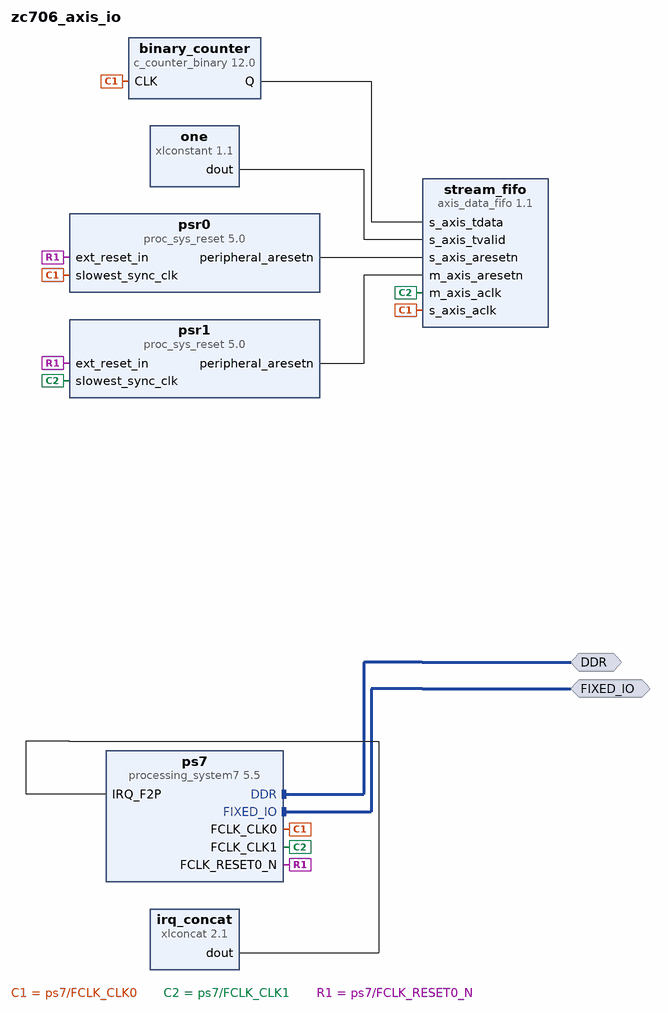
[diagram p0: block diagram of the top level]
# Vivado block design zc706_axis_io, xc7z045ffg900-2, Vivado 2016.3_sdx
create_bd_design zc706_axis_io

create_bd_intf_port -mode Master -vlnv xilinx.com:interface:ddrx_rtl:1.0 DDR
create_bd_intf_port -mode Master -vlnv xilinx.com:display_processing_system7:fixedio_rtl:1.0 FIXED_IO

create_bd_cell -type ip -vlnv xilinx.com:ip:c_counter_binary:12.0 binary_counter
set_property -dict {CONFIG.Output_Width 32} [get_bd_cells binary_counter]
create_bd_cell -type ip -vlnv xilinx.com:ip:xlconcat:2.1 irq_concat
set_property -dict {CONFIG.NUM_PORTS 1} [get_bd_cells irq_concat]
create_bd_cell -type ip -vlnv xilinx.com:ip:xlconstant:1.1 one
create_bd_cell -type ip -vlnv xilinx.com:ip:processing_system7:5.5 ps7
set_property -dict [list \
  CONFIG.PCW_FPGA1_PERIPHERAL_FREQMHZ 50 \
  CONFIG.PCW_USE_M_AXI_GP0 0 \
  CONFIG.PCW_USE_FABRIC_INTERRUPT 1 \
  CONFIG.PCW_EN_CLK1_PORT 1 \
  CONFIG.PCW_IRQ_F2P_INTR 1 \
  CONFIG.PCW_QSPI_GRP_IO1_ENABLE 1 \
  CONFIG.PCW_TTC0_PERIPHERAL_ENABLE 1 \
  CONFIG.preset ZC706 \
] [get_bd_cells ps7]
create_bd_cell -type ip -vlnv xilinx.com:ip:proc_sys_reset:5.0 psr0
create_bd_cell -type ip -vlnv xilinx.com:ip:proc_sys_reset:5.0 psr1
create_bd_cell -type ip -vlnv xilinx.com:ip:axis_data_fifo:1.1 stream_fifo
set_property -dict {CONFIG.TDATA_NUM_BYTES 4 CONFIG.FIFO_DEPTH 512 CONFIG.IS_ACLK_ASYNC 1} [get_bd_cells stream_fifo]

# ---- connections ----

connect_bd_intf_net -intf_net processing_system7_0_DDR [get_bd_intf_ports DDR] [get_bd_intf_pins ps7/DDR]
connect_bd_intf_net -intf_net processing_system7_0_FIXED_IO [get_bd_intf_ports FIXED_IO] [get_bd_intf_pins ps7/FIXED_IO]
connect_bd_net [get_bd_pins binary_counter/Q] [get_bd_pins stream_fifo/s_axis_tdata]
connect_bd_net [get_bd_pins one/dout] [get_bd_pins stream_fifo/s_axis_tvalid]
connect_bd_net -net processing_system7_0_FCLK_CLK0 [get_bd_pins ps7/FCLK_CLK0] \
  [get_bd_pins binary_counter/CLK] [get_bd_pins psr0/slowest_sync_clk] [get_bd_pins stream_fifo/s_axis_aclk]
connect_bd_net -net processing_system7_0_FCLK_CLK1 [get_bd_pins ps7/FCLK_CLK1] \
  [get_bd_pins psr1/slowest_sync_clk] [get_bd_pins stream_fifo/m_axis_aclk]
connect_bd_net -net processing_system7_0_FCLK_RESET0_N [get_bd_pins ps7/FCLK_RESET0_N] [get_bd_pins psr0/ext_reset_in] [get_bd_pins psr1/ext_reset_in]
connect_bd_net [get_bd_pins psr0/peripheral_aresetn] [get_bd_pins stream_fifo/s_axis_aresetn]
connect_bd_net [get_bd_pins psr1/peripheral_aresetn] [get_bd_pins stream_fifo/m_axis_aresetn]
connect_bd_net [get_bd_pins irq_concat/dout] [get_bd_pins ps7/IRQ_F2P]

validate_bd_design
save_bd_design
